# EAGLE design MSPBOIADV (EAGLE 9.3.0)
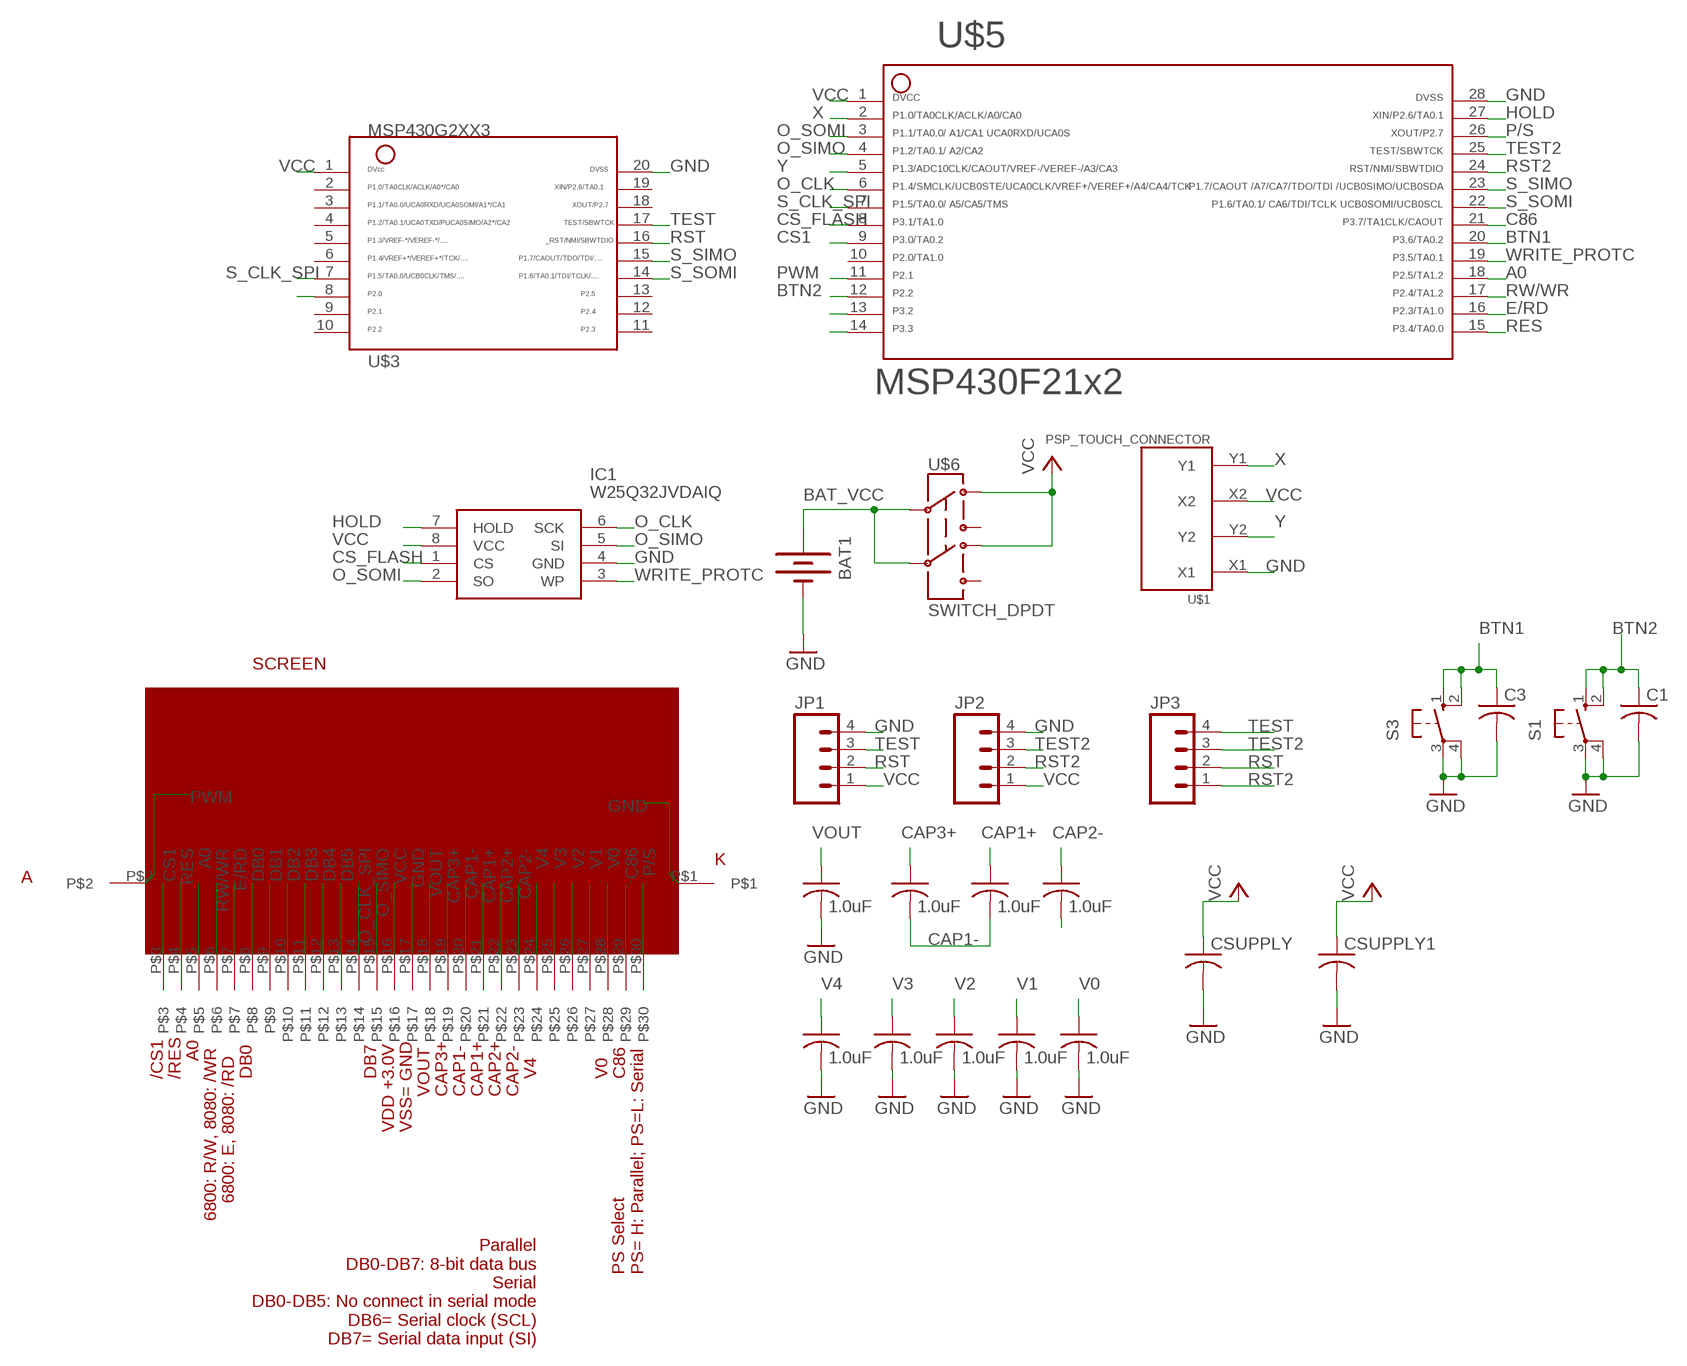
[diagram p0: schematic, sheet 1]

## Parts
1.0UF  1.0uF  C-USC1206  [C1206]
1.0UF1  1.0uF  C-USC1206  [C1206]
BAT1  BATTERY  [BATTERY_PACK_2AA]
C1  C-USC1206  [C1206]
C3  C-USC1206  [C1206]
CSUPPLY  C-USC1206  [C1206]
CSUPPLY1  C-USC1206  [C1206]
IC1  W25Q32JVDAIQ  [DIP902W46P254L959H533Q8N]
JP1  M04LOCK  [1X04_LOCK]
JP2  M04LOCK  [1X04_LOCK]
JP3  M04LOCK  [1X04_LOCK]
S1  10-XX  [B3F-10XX]
S3  10-XX  [B3F-10XX]
U$1  PSP_TOUCH_CONNECTOR  [PSP_TOUCH_CONNECTOR]
U$2  SCREEN  [DISPLAY_128_64]
U$3  MSP430G2XX3TSSOP  [PW20]
U$5  USETHIS  [PW28]
U$6  SWITCH_DPDT  [JS_DPDT_TH]
VOUTCAP  1.0uF  C-USC1206  [C1206]
VOUTCAP1  1.0uF  C-USC1206  [C1206]
VOUTCAP2  1.0uF  C-USC1206  [C1206]
VOUTCAP3  1.0uF  C-USC1206  [C1206]
VOUTCAP4  1.0uF  C-USC1206  [C1206]
VOUTCAP5  1.0uF  C-USC1206  [C1206]
VOUTCAP6  1.0uF  C-USC1206  [C1206]

## Nets
A0: U$2.P$5 U$5.18
BAT_VCC: BAT1.3V(+) U$6.2 U$6.5
BTN1: C3.1 S3.1(S) S3.2(S1) U$5.20
BTN2: C1.1 S1.1(S) S1.2(S1) U$5.12
C86: U$2.P$29 U$5.21
CAP1+: 1.0UF1.1 U$2.P$21
CAP1-: 1.0UF1.2 1.0UF.2 U$2.P$20
CAP2+: U$2.P$22 VOUTCAP1.2
CAP2-: U$2.P$23 VOUTCAP1.1
CAP3+: 1.0UF.1 U$2.P$19
CHP_SLCT: U$3.8
CS1: U$2.P$3 U$5.9
CS_FLASH: IC1.1(CS) U$5.8
DB0: U$2.P$8
DB1: U$2.P$9
DB2: U$2.P$10
DB3: U$2.P$11
DB4: U$2.P$12
DB5: U$2.P$13
E/RD: U$2.P$7 U$5.16
GND: BAT1.GND(-) C1.2 C3.2 CSUPPLY1.2 CSUPPLY.2 IC1.4(GND) JP1.4 JP2.4 S1.3(P) S1.4(P1) S3.3(P) S3.4(P1) U$1.X1 U$2.P$1 U$2.P$17 U$3.20 U$5.28 VOUTCAP2.2 VOUTCAP3.2 VOUTCAP4.2 VOUTCAP5.2 VOUTCAP6.2 VOUTCAP.2
HOLD: IC1.7(HOLD) U$5.27
N$13: U$5.13
N$14: U$5.14
O_CLK: IC1.6(SCK) U$5.6
O_CLK_SPI: U$2.P$14
O_SIMO: IC1.5(SI) U$2.P$15 U$5.4
O_SOMI: IC1.2(SO) U$5.3
P/S: U$2.P$30 U$5.26
PWM: U$2.P$2 U$5.11
RES: U$2.P$4 U$5.15
RST: JP1.2 JP3.2 U$3.16
RST2: JP2.2 JP3.1 U$5.24
RW/WR: U$2.P$6 U$5.17
S_CLK_SPI: U$3.7 U$5.7
S_SIMO: U$3.15 U$5.23
S_SOMI: U$3.14 U$5.22
TEST: JP1.3 JP3.4 U$3.17
TEST2: JP2.3 JP3.3 U$5.25
V0: U$2.P$28 VOUTCAP6.1
V1: U$2.P$27 VOUTCAP5.1
V2: U$2.P$26 VOUTCAP4.1
V3: U$2.P$25 VOUTCAP3.1
V4: U$2.P$24 VOUTCAP2.1
VCC: CSUPPLY1.1 CSUPPLY.1 IC1.8(VCC) JP1.1 JP2.1 U$1.X2 U$2.P$16 U$3.1 U$5.1 U$6.1 U$6.4
VOUT: U$2.P$18 VOUTCAP.1
WRITE_PROTC: IC1.3(WP) U$5.19
X: U$1.Y1 U$5.2
Y: U$1.Y2 U$5.5
Unconnected: U$3.2 U$3.3 U$3.4 U$3.5 U$3.6 U$3.9 U$3.10 U$3.11 U$3.12 U$3.13 U$3.18 U$3.19 U$5.10 U$6.3 U$6.6

## Library data of the parts
1.0UF 1.0UF1 C1 C3 VOUTCAP VOUTCAP1-VOUTCAP6 = rcl:C-US: CAPACITOR, American symbol; SPICEPREFIX: C
BAT1 = ELEC327:BATTERY: Battery Holders Various common sizes : AA, AAA, 20mm coin cell and 12mm coin cell. 20MM_4LEGS, BATT-10373
CSUPPLY CSUPPLY1 = rcl:C-US: CAPACITOR, American symbol
IC1 = W25Q32JVDAIQ:W25Q32JVDAIQ: NOR Flash spiFlash, 32M-bit, DTR, 4Kb Uniform Sector Source: Datasheet <https://mouser.componentsearchengine.com/Datasheets/1/W25Q32JVDAIQ.pdf>; DESCRIPTION: NOR Flash spiFlash, 32M-bit, DTR, 4Kb Uniform Sector; HEIGHT: 5.33mm; MANUFACTURER_NAME: Winbond; MANUFACTURER_PART_NUMBER: W25Q32JVDAIQ
JP1-JP3 = SparkFun:M04: Header 4 Standard 4-pin 0.1" header. Use with straight break away headers (SKU : PRT-00116), right angle break away headers (PRT-00553), swiss pins (PRT-00743), machine pins (PRT-00117), and female headers (PRT-00115). Molex polarized connector foot print use with SKU : PRT-08231 with associated crimp pins and housings.
S1 S3 = switch-omron:10-XX: OMRON SWITCH; MPN: B3F-1000; OC_FARNELL: 176432; OC_NEWARK: 36M3542
U$1 = SparkFun:PSP_TOUCH_CONNECTOR: 4-Pin Connector for PSP Touch Screen
U$2 = gameconsole:SCREEN
U$3 = ELEC327:MSP430G2XX3: MSP430G2XX3 PDIP (N) 20 Pin Package
U$5 = TI_MSP430_v16:USETHIS: *** MSP430F21x2 *** PW28
U$6 = ELEC327:SWITCH_DPDT

## Board
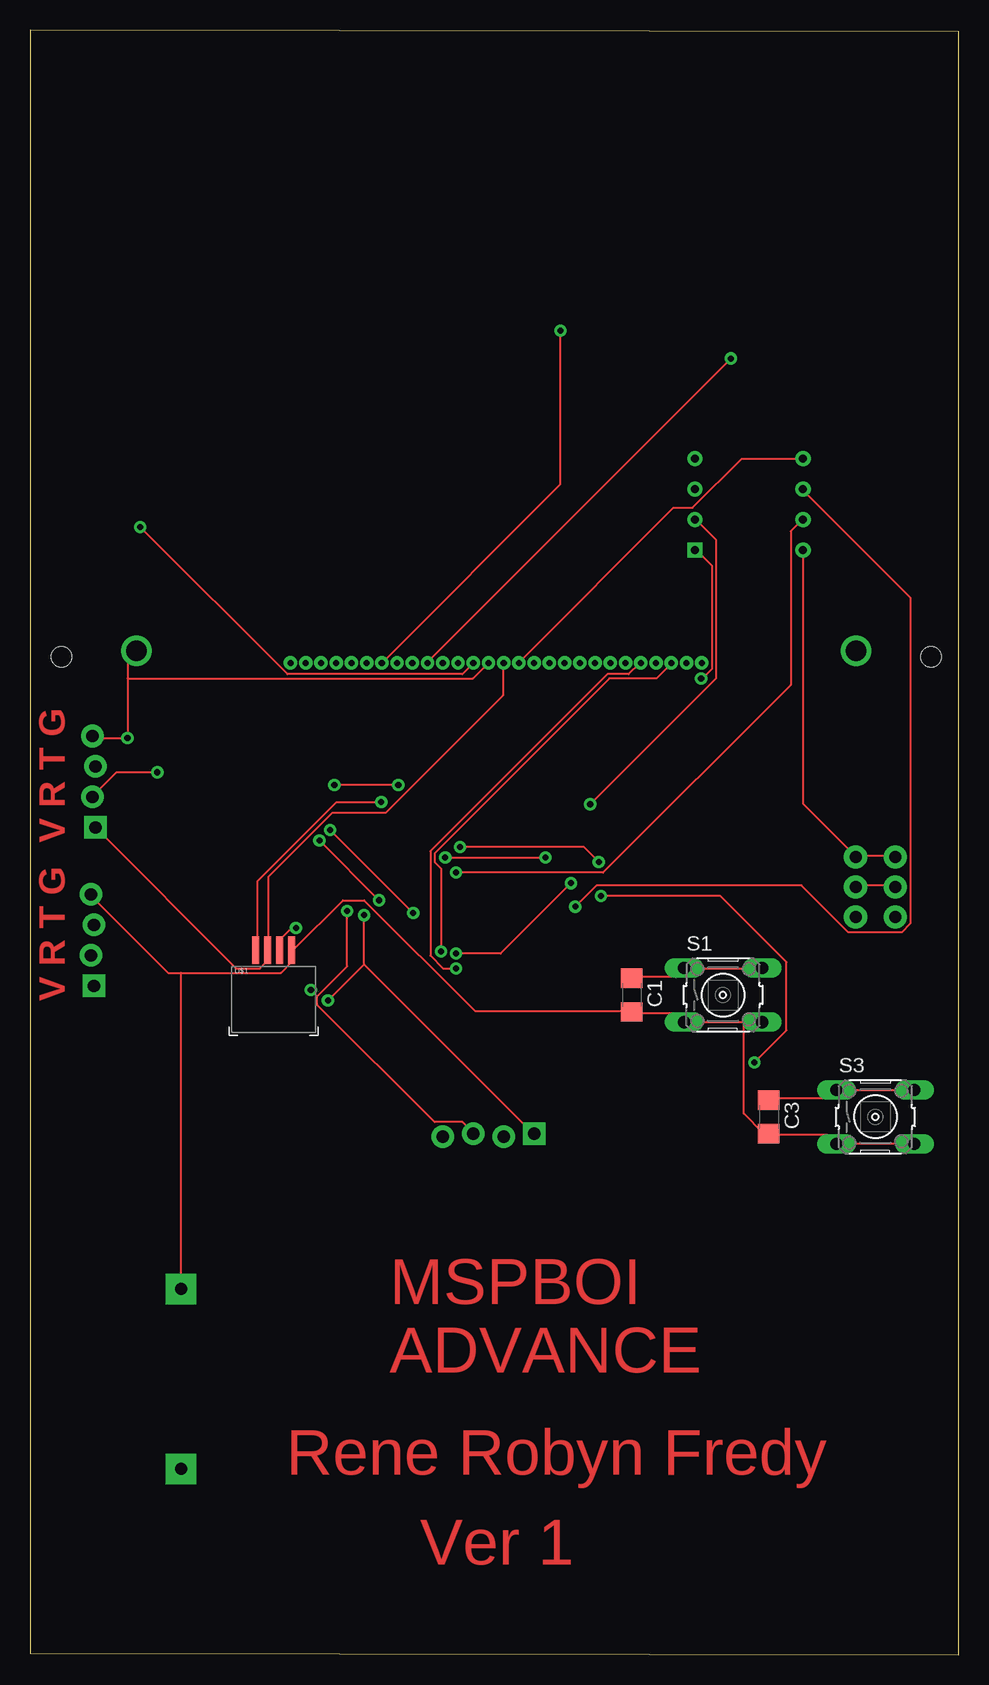
[diagram p1: board, top side]
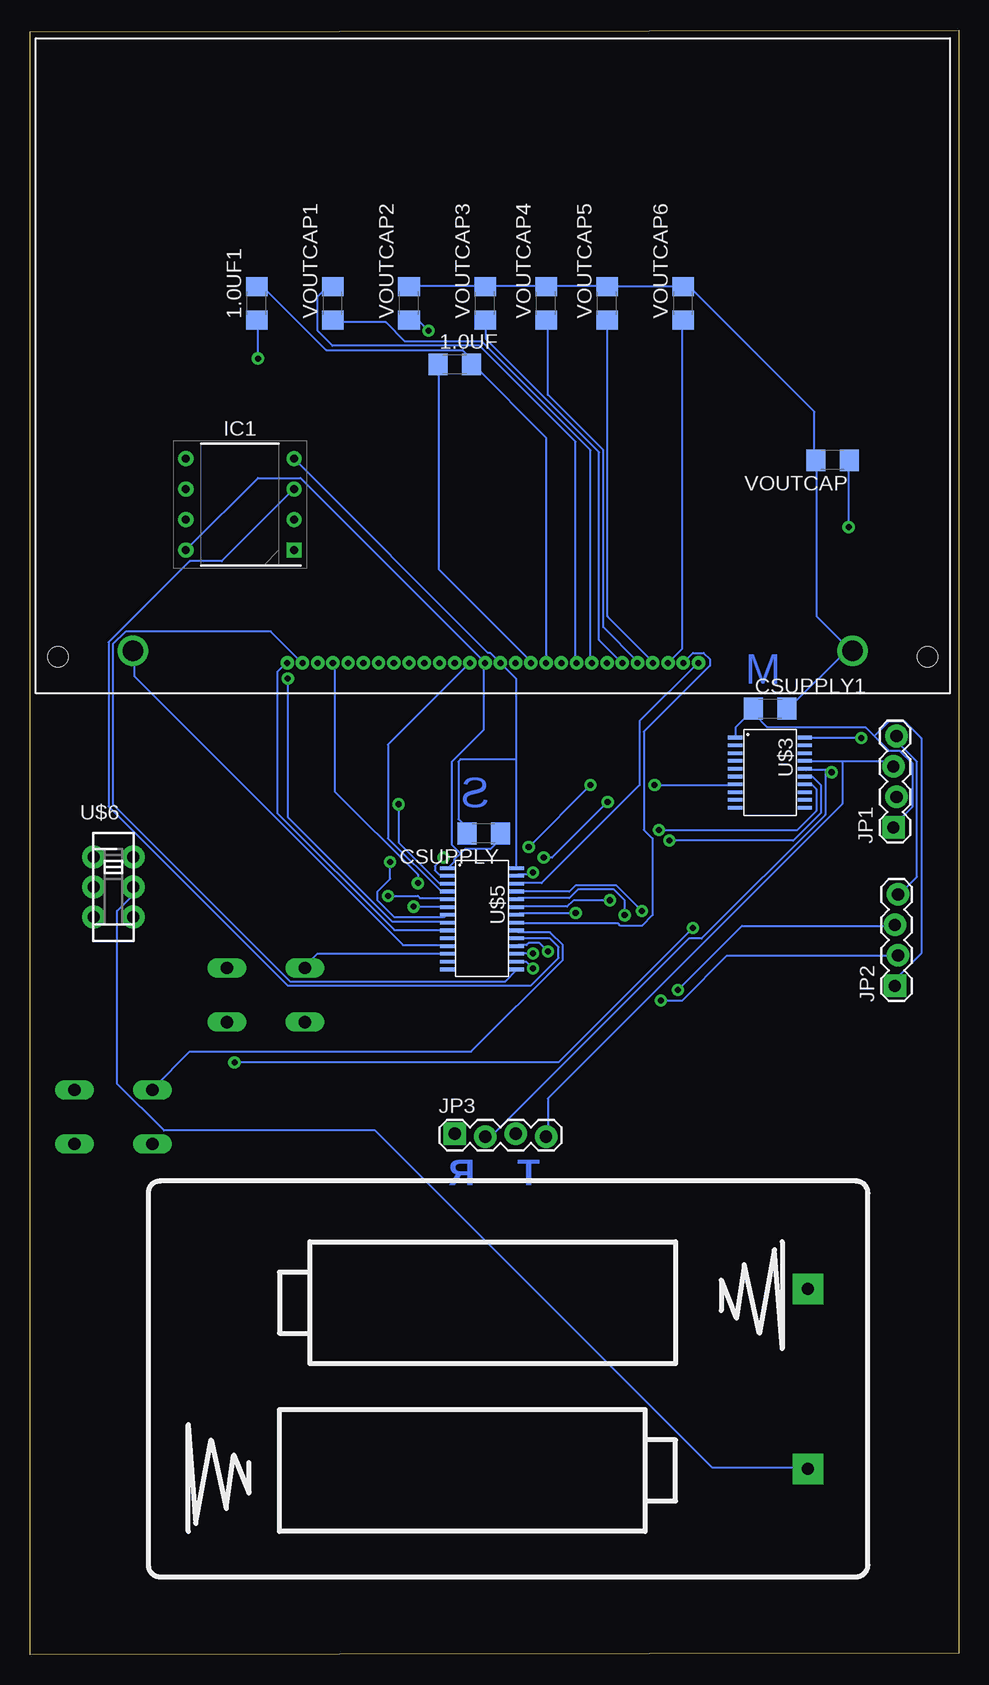
[diagram p2: board, bottom side, seen from below]

Size 77.45 x 135.43 mm. Coordinates in mm from the lower left corner, seen from the top.
Outline: 0,0.13 77.45,0 77.45,135.31 0,135.43 0,0.13
Copper layers (1*16): Top 0.035mm / dielectric 1.5mm / Bottom 0.035mm
Design rules "AdvancedCircuitsBarebones_SafeClearances": minimum track width 7mil, minimum drill 20mil, track to track 7mil, track to pad 7mil, pad to pad 7mil, via to via 7mil, smd to smd 7mil, copper to edge 10mil, drill to drill 6mil, minimum pad ring 12mil, minimum via ring 10mil, stop-mask expansion 4mil, vias tented up to drill 25mil, thermal gap 10mil
tRestrict: area 53.5,53.7 to 62.2,56.3; area 66.3,43.6 to 74.7,46.1; area 60.6,44.3 to 62.6,45.3; area 49.1,54.5 to 51.2,55.5
bRestrict: area 53.7,43.9 to 54.7,45.8; area 13.5,70 to 17.9,77.1; area 37.6,56.6 to 41.9,66.2; area 10,98.6 to 11,100.6; area 22,112.1 to 24,113.2; area 28.3,112.1 to 30.4,113.2; area 33.4,112.1 to 35.4,113.2; area 38.5,112.1 to 40.5,113.2; area 44.8,112.1 to 46.9,113.2; area 51.2,112.1 to 53.2,113.2; area 57.5,112.1 to 59.6,113.2; area 41.5,106.6 to 42.5,108.6; 2 more areas

### Footprints (pad centres in the part's own frame; a part is rotated, then mirrored left to right if it is on the bottom)
C1206 = smd 1.6 x 1.8: 1 -1.4,0; 2 1.4,0
BATTERY_PACK_2AA = drill 1 pad 2.54 square: 3V 7.5,25; GND -7.5,25
DIP902W46P254L959H533Q8N = drill 0.66 pad 1.06 square: 1 -4.51,3.81 | drill 0.66 pad 1.06: 2 -4.51,1.27; 3 -4.51,-1.27; 4 -4.51,-3.81; 5 4.51,-3.81; 6 4.51,-1.27; 7 4.51,1.27; 8 4.51,3.81
1X04_LOCK = drill 1.016 pad 1.88 square: 1 0,0.127 | drill 1.016 pad 1.88: 2 2.54,-0.127; 3 5.08,0.127; 4 7.62,-0.127
B3F-10XX = drill 1.016 long: 1 -3.251,2.261; 2 3.251,2.261; 3 -3.251,-2.261; 4 3.251,-2.261
PSP_TOUCH_CONNECTOR = smd 0.6 x 2.3: X1 1.5,2.85; X2 -0.5,2.85; Y1 -1.5,2.85; Y2 0.5,2.85
DISPLAY_128_64 = drill 1.7: P$1 30,1; P$2 -30,1 | drill 0.508: P$3 -17.145,0; P$4 -15.875,0; P$5 -14.605,0; P$6 -13.335,0; P$7 -12.065,0; P$8 -10.795,0; P$9 -9.525,0; P$10 -8.255,0; P$11 -6.985,0; P$12 -5.715,0; P$13 -4.445,0; P$14 -3.175,0; P$15 -1.905,0; P$16 -0.635,0; P$17 0.635,0; P$18 1.905,0; P$19 3.175,0; P$20 4.445,0; P$21 5.715,0; P$22 6.985,0; P$23 8.255,0; P$24 9.525,0; P$25 10.795,0; P$26 12.065,0; P$27 13.335,0; P$28 14.605,0 | drill 0.508 pad 0.991: P$29 15.875,0; P$30 17.145,0 | hole 1.7: -36.25,0.5; 36.25,0.5
PW20 = smd 0.3 x 1.2: 1 -2.925,-2.9; 2 -2.275,-2.9; 3 -1.625,-2.9; 4 -0.975,-2.9; 5 -0.325,-2.9; 6 0.325,-2.9; 7 0.975,-2.9; 8 1.625,-2.9; 9 2.275,-2.9; 10 2.925,-2.9; 11 2.925,2.9; 12 2.275,2.9; 13 1.625,2.9; 14 0.975,2.9; 15 0.325,2.9; 16 -0.325,2.9; 17 -0.975,2.9; 18 -1.625,2.9; 19 -2.275,2.9; 20 -2.925,2.9
PW28 = smd 0.3 x 1.2: 1 -4.229,-2.908; 2 -3.579,-2.908; 3 -2.929,-2.908; 4 -2.279,-2.908; 5 -1.629,-2.908; 6 -0.979,-2.908; 7 -0.329,-2.908; 8 0.321,-2.908; 9 0.971,-2.908; 10 1.621,-2.908; 11 2.271,-2.908; 12 2.921,-2.908; 13 3.571,-2.908; 14 4.221,-2.908; 15 4.221,2.892; 16 3.571,2.892; 17 2.921,2.892; 18 2.271,2.892; 19 1.621,2.892; 20 0.971,2.892; 21 0.321,2.892; 22 -0.329,2.892; 23 -0.979,2.892; 24 -1.629,2.892; 25 -2.279,2.892; 26 -2.929,2.892; 27 -3.579,2.892; 28 -4.229,2.892
JS_DPDT_TH = drill 1 pad 1.93: 1 -2.5,-1.65; 2 0,-1.65; 3 2.5,-1.65; 4 -2.5,1.65; 5 0,1.65; 6 2.5,1.65

### Placement (x,y rotation side)
1.0UF  42.04,107.57 0 bottom
1.0UF1  58.55,112.65 90 bottom
BAT1  37.59,22.99 270 bottom
C1  50.16,54.99 270 top
C3  61.6,44.83 270 top
CSUPPLY  39.62,68.45 180 bottom
CSUPPLY1  15.75,78.87 0 bottom
IC1  59.94,95.88 180 bottom
JP1  5.33,68.96 90 bottom
JP2  5.21,55.75 90 bottom
JP3  42.04,43.31 0 bottom
S1  57.79,54.99 0 top
S3  70.48,44.83 0 top
U$1  20.32,55.88 0 top
U$2  38.86,82.68 0 bottom
U$3  15.75,73.53 270 bottom
U$5  39.75,61.34 270 bottom
U$6  70.48,64.01 270 bottom
VOUTCAP  10.54,99.57 180 bottom
VOUTCAP1  52.2,112.65 90 bottom
VOUTCAP2  45.85,112.65 90 bottom
VOUTCAP3  39.5,112.65 90 bottom
VOUTCAP4  34.42,112.65 90 bottom
VOUTCAP5  29.34,112.65 90 bottom
VOUTCAP6  22.99,112.65 90 bottom

### Tracks (layer width: path | path; a pad name or v marks a point on that pad's centre or on a via)
A0  (via drill 0.51)
  Top 0.178: v34.27,58.62 34.27,65.56 33.73,66.09 33.73,66.8 48.31,81.38 52.22,81.38 53.47,82.63 U$2.P$5
  Bottom 0.178: v34.27,58.62 34.98,59.33 35.87,59.33 36.04,59.16 36.75,59.16 U$5.18
BAT_VCC
  Top 0.178: U$6.5 68.94,64.13 71.96,64.13 U$6.2
  Bottom 0.178: U$6.5 68.94,63.96 68.94,63.25 70.18,62 70.18,47.6 66.27,43.69 48.67,43.69 20.57,15.6 12.75,15.6 BAT1.3V
BTN1
  Top 0.178: C3.1 61.65,46.36 66.45,46.36 67.16,47.07 S3.1 67.33,47.07 73.74,47.07 S3.2
  Bottom 0.178: U$5.20 36.75,60.22 34.09,60.22 33.02,59.16 33.02,57.91 40.66,50.27 64.13,50.27 67.16,47.24 S3.1
BTN2
  Top 0.178: 54.53,57.2 53.82,56.49 50.27,56.49 C1.1 | 54.53,57.2 60.94,57.2 S1.2 | 54.53,57.2 S1.1
  Bottom 0.178: U$5.12 42.8,58.45 53.47,58.45 54.53,57.38 S1.1
C86
  Bottom 0.178: U$5.21 36.75,60.94 28.4,60.94 28.22,60.76 26.44,60.76 25.55,61.65 25.55,68.05 26.26,68.76 26.26,76.94 20.75,82.45 20.75,82.98 21.29,83.52 22.17,83.52 22.89,82.8 U$2.P$29
CAP1+  (via drill 0.51)
  Top 0.178: v58.45,108.05 33.2,82.8 U$2.P$21
  Bottom 0.178: v58.45,108.05 58.45,111.07 1.0UF1.1
CAP1-
  Bottom 0.178: 1.0UF1.2 58.45,113.92 57.91,113.92 52.76,108.76 41.38,108.76 40.66,108.05 40.66,107.7 1.0UF.2 40.49,107.52 34.44,101.47 34.44,82.8 U$2.P$20
CAP2+
  Bottom 0.178: VOUTCAP1.2 52.22,113.92 52.76,113.92 53.47,113.21 53.47,110.36 52.22,109.12 39.95,109.12 31.95,101.12 31.95,82.8 U$2.P$22
CAP2-
  Bottom 0.178: VOUTCAP1.1 52.05,111.07 47.78,111.07 46.18,109.47 39.78,109.47 30.71,100.41 30.71,82.8 U$2.P$23
CAP3+
  Bottom 0.178: 1.0UF.1 43.33,107.52 43.33,90.45 35.69,82.8 U$2.P$19
CS1
  Bottom 0.178: U$5.9 42.8,60.4 47.07,60.4 56.84,70.18 56.84,81.91 56.13,82.63 U$2.P$3
CS_FLASH  (via drill 0.51)
  Top 0.178: v55.96,81.38 56.08,81.38 56.84,82.14 56.84,90.8 55.6,92.05 IC1.1
  Bottom 0.178: v55.96,81.38 55.96,69.82 47.24,61.11 42.8,61.11 U$5.8
E/RD  (via drill 0.51)
  Top 0.178: v35.51,57.2 34.44,57.2 33.38,58.27 33.38,66.98 48.13,81.74 49.91,81.74 50.8,82.63 U$2.P$7
  Bottom 0.178: v35.51,57.2 36.04,57.73 36.75,57.73 U$5.16
GND  (via drill 0.51)
  Top 0.178: JP1.4 5.28,76.58 5.46,76.4 v8.13,76.4 8.13,81.38 | 8.13,81.38 8.13,82.8 8.84,83.52 U$2.P$1 | U$2.P$17 36.93,81.38 8.13,81.38 | 54.53,52.76 53.82,53.47 50.27,53.47 C1.2 50.09,53.65 37.11,53.65 27.86,62.89 26.09,62.89 22,58.8 U$1.X1 21.82,58.62 21.82,57.73 20.93,56.85 12.57,56.85 | 54.53,52.76 59.51,52.76 | 59.51,52.76 60.94,52.76 S1.4 59.51,52.76 | 54.53,52.76 S1.3 | S3.4 73.74,42.62 67.33,42.62 S3.3 67.16,42.62 66.45,43.33 61.65,43.33 C3.2 61.47,43.51 61.11,43.51 59.51,45.11 59.51,52.76 | 12.57,56.85 11.51,56.85 5.1,63.25 JP2.4 | 12.57,56.85 12.57,30.53 BAT1.GND
  Bottom 0.178: 36.93,74.62 36.93,81.38 U$2.P$17 39.06,83.52 39.24,83.52 IC1.4 | 36.93,74.62 36.93,65.56 U$5.28 | 36.93,74.62 41.55,74.62 41.73,74.45 41.73,69.65 41.2,69.11 41.2,68.58 CSUPPLY.2 | VOUTCAP2.2 45.82,114.1 39.6,114.1 VOUTCAP3.2 39.42,114.1 34.44,114.1 VOUTCAP4.2 34.27,114.1 29.46,114.1 VOUTCAP5.2 29.29,114.1 23.06,114.1 VOUTCAP6.2 22.89,113.92 22.35,113.92 12.04,103.61 12.04,99.69 VOUTCAP.2 11.86,99.52 11.86,86.54 9.2,83.87 | v8.13,76.4 12.75,76.4 U$3.20 | 9.2,83.87 9.02,83.69 U$2.P$1 9.2,83.87 | 9.2,83.87 14.17,78.89 CSUPPLY1.2 | JP1.4 5.1,76.58 5.1,76.05 3.5,74.45 3.5,64.85 4.93,63.42 JP2.4
HOLD  (via drill 0.51)
  Top 0.178: v35.51,65.2 47.78,65.2 63.42,80.85 63.42,93.65 64.31,94.54 IC1.7
  Bottom 0.178: v35.51,65.2 35.69,65.02 36.75,65.02 U$5.27
O_CLK  (via drill 0.51)
  Top 0.178: v45.47,62.36 47.24,64.13 64.31,64.13 68.22,60.22 72.67,60.22 73.38,60.94 73.38,88.14 64.49,97.03 IC1.6
  Bottom 0.178: v45.47,62.36 42.8,62.36 U$5.6
O_SIMO
  Top 0.178: IC1.5 59.33,99.69 55.24,95.61 53.65,95.61 40.84,82.8 U$2.P$15
  Bottom 0.178: U$5.4 42.8,63.6 43.16,63.6 47.6,68.05 47.6,75.87 40.84,82.63 U$2.P$15
O_SOMI  (via drill 0.51)
  Top 0.178: v46.71,70.89 57.2,81.38 57.2,92.94 55.6,94.54 IC1.2
  Bottom 0.178: v46.71,70.89 46.71,67.69 43.33,64.31 42.8,64.31 U$5.3
P/S
  Bottom 0.178: U$5.26 36.75,64.31 34.8,64.31 26.62,72.49 26.62,77.83 21.82,82.63 U$2.P$30
PWM
  Bottom 0.178: U$5.11 42.8,59.16 46.36,59.16 68.76,81.56 68.76,83.52 U$2.P$2
RES
  Bottom 0.178: U$5.15 36.93,57.02 37.82,56.13 55.78,56.13 70.54,70.89 70.54,84.23 69.47,85.29 57.38,85.29 54.89,82.8 U$2.P$4
RST  (via drill 0.51)
  Top 0.178: v10.62,73.56 7.24,73.56 5.28,71.6 JP1.2
  Bottom 0.178: 11.15,73.74 10.8,73.74 v10.62,73.56 | 11.15,73.74 12.75,73.74 U$3.16 | 11.15,73.74 11.15,70 21.46,59.69 22.53,59.69 38.89,43.33 39.42,43.33 JP3.2
RST2  (via drill 0.51)
  Top 0.178: 27.86,57.56 v27.86,61.65 | 27.86,57.56 41.91,43.51 JP3.1 | 27.86,57.56 v24.84,54.53
  Bottom 0.178: v27.86,61.65 27.86,62.89 28.75,63.78 31.77,63.78 32.49,63.07 36.75,63.07 U$5.24 | v24.84,54.53 23.06,54.53 19.33,58.27 5.1,58.27 JP2.2
RW/WR  (via drill 0.51)
  Top 0.178: v35.51,58.45 39.24,58.45 v45.11,64.31
  Bottom 0.178: v35.51,58.45 36.75,58.45 U$5.17 | v45.11,64.31 45.11,65.02 52.05,71.96 52.05,82.63 U$2.P$6
S_CLK_SPI  (via drill 0.51)
  Top 0.178: v30.71,72.49 v25.38,72.49 | v35.87,67.33 46.18,67.33 v47.42,66.09
  Bottom 0.178: v25.38,72.49 18.8,72.49 U$3.7 | v35.87,67.33 v30.71,72.49 | v47.42,66.09 47.42,64.67 48.49,63.6 48.49,62.89 47.07,61.47 42.98,61.47 42.8,61.65 U$5.7
S_SIMO  (via drill 0.51)
  Top 0.178: v24.13,67.87 v29.11,62.89
  Bottom 0.178: v29.11,62.89 32.13,62.89 32.66,62.36 36.75,62.36 U$5.23 | v24.13,67.87 13.82,67.87 11.51,70.18 11.51,72.49 12.22,73.2 12.75,73.2 U$3.15
S_SOMI  (via drill 0.51)
  Top 0.178: v31.95,61.82 v25.02,68.76
  Bottom 0.178: v25.02,68.76 13.46,68.76 11.86,70.36 11.86,72.14 12.22,72.49 12.75,72.49 U$3.14 | v31.95,61.82 36.58,61.82 36.75,61.65 U$5.22
TEST
  Bottom 0.178: 9.73,74.45 5.82,74.45 5.46,74.09 JP1.3 | 9.73,74.45 12.75,74.45 U$3.17 | 9.73,74.45 9.73,70.89 34.27,46.36 34.27,43.33 JP3.4
TEST2  (via drill 0.51)
  Top 0.178: v26.44,62 26.44,57.38 23.95,54.89 | 23.95,54.89 23.95,54.18 33.73,44.4 36.04,44.4 36.93,43.51 JP3.3 | 23.95,54.89 v23.42,55.42
  Bottom 0.178: v26.44,62 28.57,64.13 31.95,64.13 32.49,63.6 36.75,63.6 U$5.25 | v23.42,55.42 18.09,60.76 5.46,60.76 JP2.3
V0
  Bottom 0.178: U$2.P$28 23.06,83.87 23.06,111.07 VOUTCAP6.1
V1
  Bottom 0.178: VOUTCAP5.1 29.29,111.07 29.29,86.54 25.55,82.8 U$2.P$27
V2
  Bottom 0.178: VOUTCAP4.1 34.27,111.07 34.27,105.03 29.64,100.41 29.64,85.65 26.8,82.8 U$2.P$26
V3
  Bottom 0.178: VOUTCAP3.1 39.42,111.07 39.42,109.65 30,100.23 30,84.58 28.22,82.8 U$2.P$25
V4  (via drill 0.51)
  Top 0.178: v44.22,110.36 44.22,97.56 U$2.P$24
  Bottom 0.178: v44.22,110.36 44.93,111.07 45.82,111.07 VOUTCAP2.1
VCC
  Top 0.178: JP1.1 5.46,68.94 17.2,57.2 19.15,57.2 19.69,57.73 19.69,58.62 U$1.X2 19.86,58.8 19.86,64.85 25.2,70.18 29.64,70.18 39.42,79.96 39.42,82.63 U$2.P$16 | IC1.8 64.49,92.05 64.49,70.89 68.76,66.62 U$6.4 68.94,66.62 71.96,66.62 U$6.1
  Bottom 0.178: U$3.1 18.62,76.58 18.62,77.29 17.2,78.71 CSUPPLY1.1 17.02,78.71 17.02,78.36 15.95,77.29 7.77,77.29 7.06,76.58 | 7.06,76.58 5.82,75.34 4.93,75.34 3.86,74.27 3.86,70.71 5.46,69.11 JP1.1 | 7.06,76.58 5.82,77.83 4.57,77.83 3.15,76.4 3.15,58.45 5.28,56.31 5.28,55.78 JP2.1 | 41.55,66.8 41.2,67.16 39.06,67.16 38.35,67.87 38.35,68.4 CSUPPLY.1 | 41.55,66.8 42.09,66.27 42.09,66.09 42.62,65.56 U$5.1 | 41.55,66.8 42.27,67.51 42.27,74.45 39.6,77.11 39.6,82.63 U$2.P$16 39.6,82.8 54.89,98.09 58.45,98.09 64.31,92.23 IC1.8
VOUT  (via drill 0.51)
  Top 0.178: v9.2,94 21.46,81.74 36.04,81.74 36.93,82.63 U$2.P$18
  Bottom 0.178: v9.2,94 9.2,99.52 VOUTCAP.1
WRITE_PROTC
  Bottom 0.178: U$5.19 36.75,59.69 34.09,59.69 33.38,58.98 33.38,58.09 35.69,55.78 55.96,55.78 70.89,70.71 70.89,84.4 64.13,91.16 61.47,91.16 55.6,97.03 IC1.3
X  (via drill 0.51)
  Top 0.178: v34.62,66.45 v42.98,66.45 | v29.29,71.07 25.55,71.07 18.97,64.49 18.97,58.8 U$1.Y1
  Bottom 0.178: v42.98,66.45 43.69,65.73 43.69,65.38 43.33,65.02 42.8,65.02 U$5.2 | v34.62,66.45 33.91,66.45 v29.29,71.07
Y  (via drill 0.51)
  Top 0.178: v47.6,63.25 57.56,63.25 63.07,57.73 63.07,52.05 v60.4,49.38 | v22.17,60.58 21.82,60.58 20.93,59.69 20.93,58.8 U$1.Y2
  Bottom 0.178: v47.6,63.25 45.11,63.25 44.93,63.07 42.8,63.07 U$5.5 | v60.4,49.38 33.38,49.38 v22.17,60.58

### Text on the board
Top: V R T G | V R T G | MSPBOI / ADVANCE | Rene Robyn Fredy | Ver 1
Bottom: M | S | T R